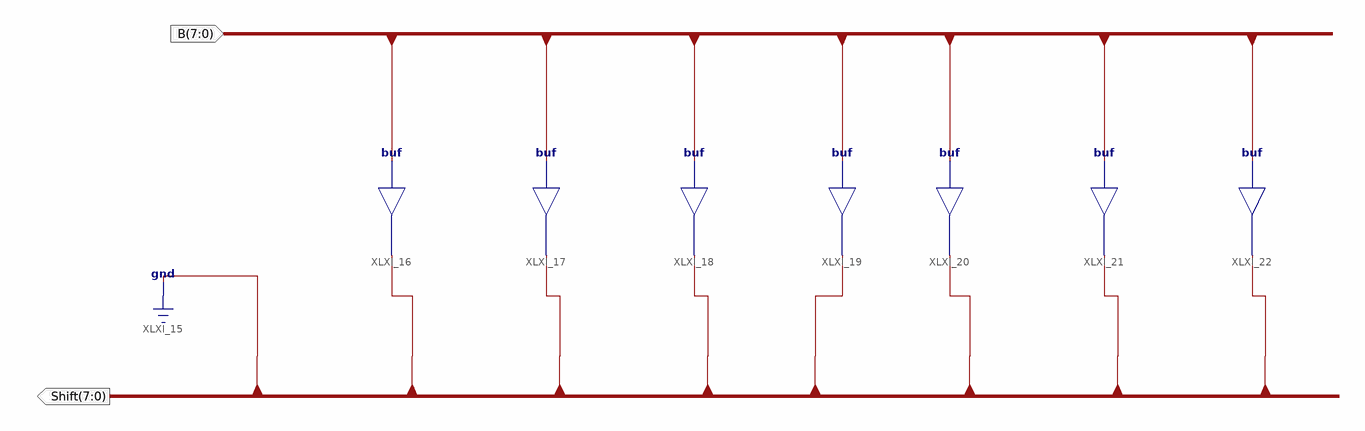
[diagram p0: schematic sheet 1]
// Xilinx ISE schematic Shifter.sch (spartan6) as structural Verilog: 7 symbols, 2 ports
module Shifter (
  input  [7:0] B,
  output [7:0] Shift
);

  buf XLXI_17 (Shift[5], B[6]);
  buf XLXI_18 (Shift[4], B[5]);
  buf XLXI_19 (Shift[3], B[4]);
  buf XLXI_20 (Shift[2], B[3]);
  buf XLXI_21 (Shift[1], B[2]);
  buf XLXI_22 (Shift[0], B[1]);
  buf XLXI_16 (Shift[6], B[7]);

  assign Shift[7] = 1'b0;
endmodule
